# EAGLE design pmodio (EAGLE 7.5.0)
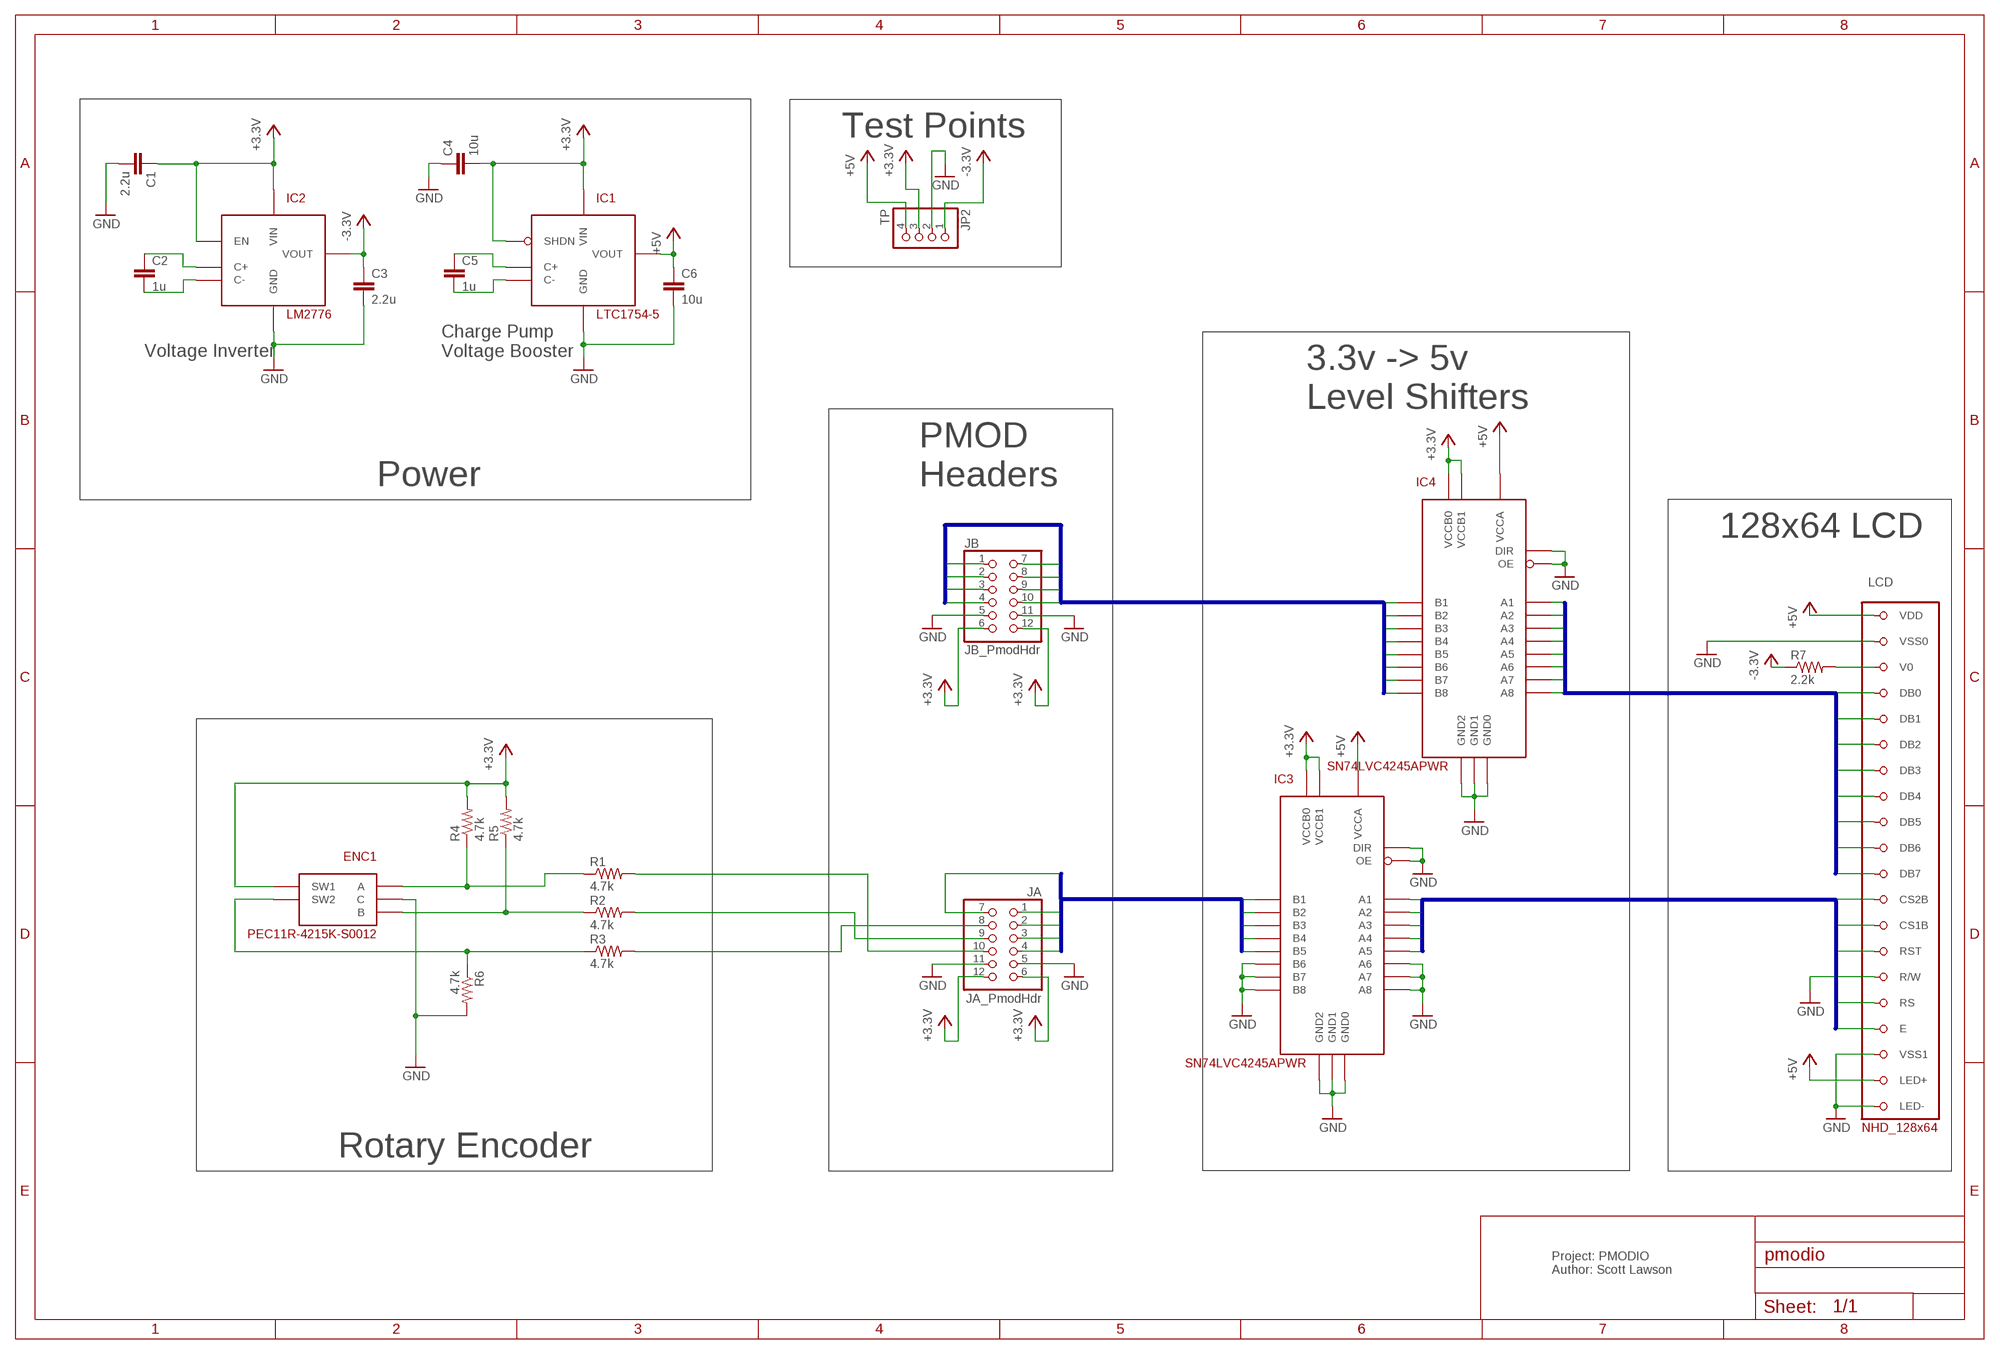
[diagram p0: schematic, sheet 1]

## Parts
C1  2.2u  CAPC0402  [C0402]
C2  1u  CAPC0402  [C0402]
C3  2.2u  CAPC0402  [C0402]
C4  10u  CAPC0802  [C0805]
C5  1u  CAPC0402  [C0402]
C6  10u  CAPC0802  [C0805]
ENC1  PEC11R-4215K-S0012  [PEC11R-4XXXF-SXXXX]
IC1  LTC1754-5  [SOT23-6]
IC2  LM2776  [SOT23-6]
IC3  SN74LVC4245APWR  [TSSOP24]
IC4  SN74LVC4245APWR  [TSSOP24]
JA  JA_PmodHdr  PINHDR-2X6/90  [2X06/90]
JB  JB_PmodHdr  PINHDR-2X6/90  [2X06/90]
JP2  TP  PINHD-1X4  [1X04]
LCD  NHD_128x64  NHD-12864MZ-FSW-GBW-L1X20_2MM  [NHD-12864MZ-FSW-GBW-L]
R1  4.7k  RESR0603  [R0603]
R2  4.7k  RESR0603  [R0603]
R3  4.7k  RESR0603  [R0603]
R4  4.7k  RESR0603  [R0603]
R5  4.7k  RESR0603  [R0603]
R6  4.7k  RESR0603  [R0603]
R7  2.2k  RESR0603  [R0603]

## Nets
+3.3V: C1.1 C4.2 ENC1.SW1 IC1.3(SHDN) IC1.5(VIN) IC2.3(VIN) IC2.4(EN) IC3.23(VCCB0) IC3.24(VCCB1) IC4.23(VCCB0) IC4.24(VCCB1) JA.6 JA.12 JB.6 JB.12 JP2.3 R4.2 R5.2
+5V: C6.1 IC1.1(VOUT) IC3.1(VCCA) IC4.1(VCCA) JP2.4 LCD.LED+ LCD.VDD
-3.3V: C3.1 IC2.1(VOUT) JP2.1 R7.1
CNTLB_3.3V0: IC3.21(B1) JA.4
CNTLB_3.3V1: IC3.20(B2) JA.3
CNTLB_3.3V2: IC3.19(B3) JA.2
CNTLB_3.3V3: IC3.18(B4) JA.7
CNTLB_3.3V4: IC3.17(B5) JA.1
CNTLB_5V0: IC3.3(A1) LCD.CS2B
CNTLB_5V1: IC3.4(A2) LCD.CS1B
CNTLB_5V2: IC3.5(A3) LCD.RST
CNTLB_5V3: IC3.6(A4) LCD.RS
CNTLB_5V4: IC3.7(A5) LCD.E
DB_3.3V0: IC4.21(B1) JB.10
DB_3.3V1: IC4.20(B2) JB.4
DB_3.3V2: IC4.19(B3) JB.9
DB_3.3V3: IC4.18(B4) JB.3
DB_3.3V4: IC4.17(B5) JB.8
DB_3.3V5: IC4.16(B6) JB.2
DB_3.3V6: IC4.15(B7) JB.7
DB_3.3V7: IC4.14(B8) JB.1
DB_5V0: IC4.3(A1) LCD.DB0
DB_5V1: IC4.4(A2) LCD.DB1
DB_5V2: IC4.5(A3) LCD.DB2
DB_5V3: IC4.6(A4) LCD.DB3
DB_5V4: IC4.7(A5) LCD.DB4
DB_5V5: IC4.8(A6) LCD.DB5
DB_5V6: IC4.9(A7) LCD.DB6
DB_5V7: IC4.10(A8) LCD.DB7
GND: C1.2 C3.2 C4.1 C6.2 ENC1.C IC1.2(GND) IC2.2(GND) IC3.2(DIR) IC3.8(A6) IC3.9(A7) IC3.10(A8) IC3.11(GND0) IC3.12(GND1) IC3.13(GND2) IC3.14(B8) IC3.15(B7) IC3.16(B6) IC3.22(OE) IC4.2(DIR) IC4.11(GND0) IC4.12(GND1) IC4.13(GND2) IC4.22(OE) JA.5 JA.11 JB.5 JB.11 JP2.2 LCD.LED- LCD.RW(R/W) LCD.VSS0 LCD.VSS1 R6.2
N$2: LCD.V0 R7.2
N$9: C2.1 IC2.5(C+)
N$10: C2.2 IC2.6(C-)
N$11: C5.1 IC1.6(C+)
N$12: C5.2 IC1.4(C-)
N$15: ENC1.A R1.1 R4.1
N$16: ENC1.B R2.1 R5.1
N$17: ENC1.SW2 R3.1 R6.1
N$18: JA.10 R1.2
N$20: JA.8 R3.2
N$26: JA.9 R2.2

## Buses
DB_5V[0..7]
DB_3.3V[0..7]
CNTLB_5V[0..4]
CNTLB_3.3V[0..4]

## Notes on the sheet
- Test Points
- Voltage Inverter
- Charge Pump 
  Voltage Booster
- 3.3v -> 5v
  Level Shifters
- Power
- PMOD
  Headers
- 128x64 LCD
- Rotary Encoder
- Project: PMODIO
  Author: Scott Lawson

## Library data of the parts
C1-C6 = pmodio:CAP
ENC1 = pmodio:PEC11R-4215K-S0012: Bourns Quadrature Rotary Encoder
IC1 = pmodio:LTC1754-5: Linear Technology 5v Charge Pump
IC2 = pmodio:LM2776
IC3 IC4 = pmodio:SN74LVC4245APWR
JA JB = pmodio:PINHDR-2X6: PIN HEADER
JP2 = pinhead:PINHD-1X4: PIN HEADER
LCD = pmodio:NHD-12864MZ-FSW-GBW-L: Newhaven Display 128x64 Graphical LCD
R1-R7 = pmodio:RES: RESISTOR, American symbol

## Board
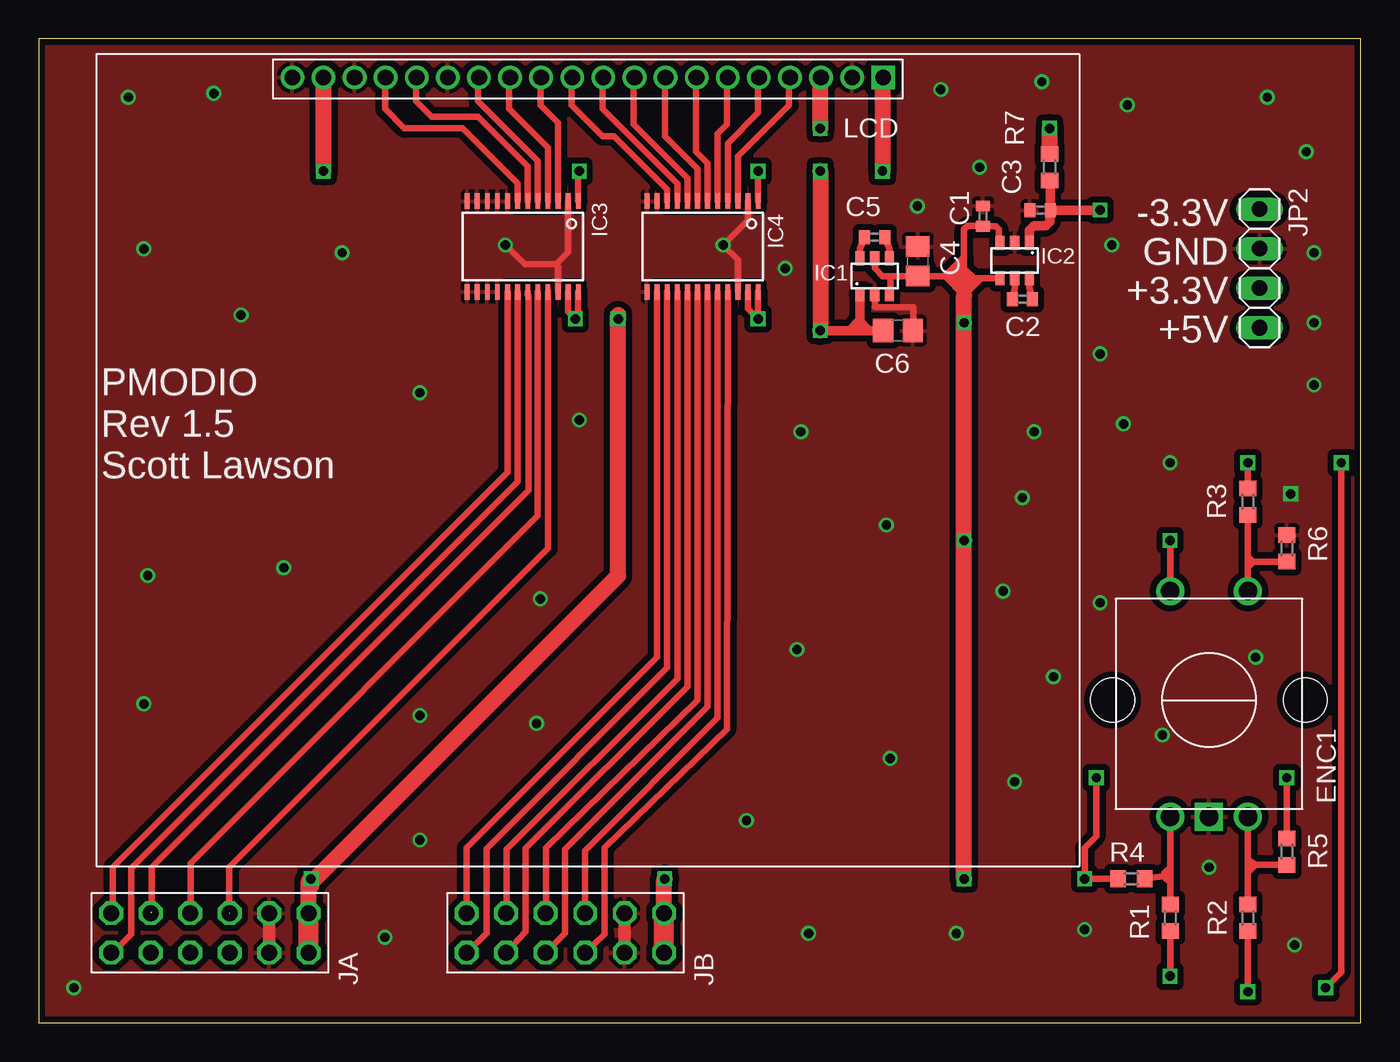
[diagram p1: board, top side]
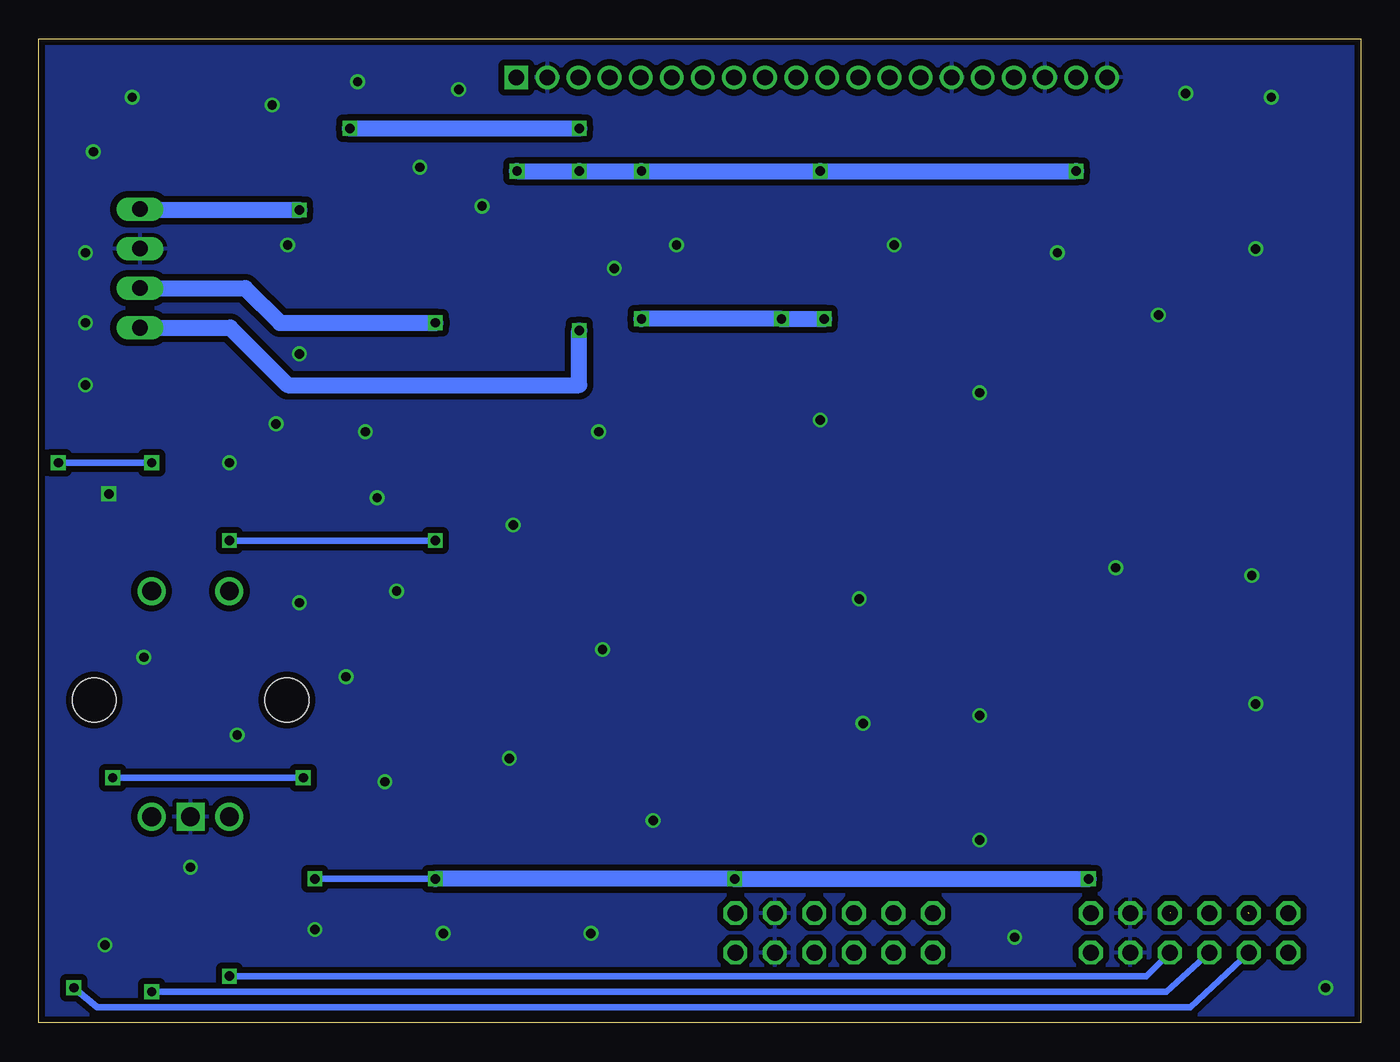
[diagram p2: board, bottom side, seen from below]

Size 85 x 63.25 mm. Coordinates in mm from the lower left corner, seen from the top.
Outline: 0,0 85,0 85,63.25 0,63.25 0,0
Copper layers (1*16): Top 0.0356mm / dielectric 1.5011mm / Bottom 0.0356mm
Design rules "LaenPCBOrder *": minimum track width 6mil, minimum drill 13mil, track to track 6mil, track to pad 6mil, pad to pad 6mil, via to via 6mil, smd to smd 6mil, copper to edge 15mil, drill to drill 6mil, minimum pad ring 7mil, minimum via ring 7mil, stop-mask expansion 3mil, vias tented up to drill 0mil, thermal gap 10mil

### Footprints (pad centres in the part's own frame; a part is rotated, then mirrored left to right if it is on the bottom)
C0402 = smd 0.7 x 0.9: 1 -0.65,0; 2 0.65,0
C0805 = smd 1.3 x 1.5: 1 -0.95,0; 2 0.95,0
PEC11R-4XXXF-SXXXX = drill 1.2: A -2.5,-7.5; B 2.5,-7.5; SW1 -2.5,7; SW2 2.5,7 | drill 1.2 square: C 0,-7.5 | hole 2.8: 6.2,0; -6.2,0
SOT23-6 = smd 0.6 x 0.9: 1 -0.95,-1.15; 2 0,-1.15; 3 0.95,-1.15; 4 0.95,1.15; 5 0,1.15; 6 -0.95,1.15
TSSOP24 = smd 0.305 x 0.991: 1 -3.575,-2.918; 2 -2.925,-2.918; 3 -2.275,-2.918; 4 -1.625,-2.918; 5 -0.975,-2.918; 6 -0.325,-2.918; 7 0.325,-2.918; 8 0.975,-2.918; 9 1.625,-2.918; 10 2.275,-2.918; 11 2.925,-2.918; 12 3.575,-2.918; 13 3.575,2.918; 14 2.925,2.918; 15 2.275,2.918; 16 1.625,2.918; 17 0.975,2.918; 18 0.325,2.918; 19 -0.325,2.918; 20 -0.975,2.918; 21 -1.625,2.918; 22 -2.275,2.918; 23 -2.925,2.918; 24 -3.575,2.918
2X06/90 = drill 1.016 octagon: 1 6.35,-6.35; 2 3.81,-6.35; 3 1.27,-6.35; 4 -1.27,-6.35; 5 -3.81,-6.35; 6 -6.35,-6.35; 7 6.35,-3.81; 8 3.81,-3.81; 9 1.27,-3.81; 10 -1.27,-3.81; 11 -3.81,-3.81; 12 -6.35,-3.81
1X04 = drill 1.016 long: 1 -3.81,0; 2 -1.27,0; 3 1.27,0; 4 3.81,0
NHD-12864MZ-FSW-GBW-L = drill 1.016: CS1B 5,-24.6; CS2B 3,-24.6; DB0 -13,-24.6; DB1 -11,-24.6; DB2 -9,-24.6; DB3 -7,-24.6; DB4 -5,-24.6; DB5 -3,-24.6; DB6 -1,-24.6; DB7 1,-24.6; E 13,-24.6; LED+ 17,-24.6; LED- 19,-24.6; RS 11,-24.6; RST 7,-24.6; RW 9,-24.6; V0 -15,-24.6; VSS0 -17,-24.6; VSS1 15,-24.6 | drill 1.016 square: VDD -19,-24.6
R0603 = smd 1 x 1.1: 1 -0.85,0; 2 0.85,0

### Placement (x,y rotation side)
C1  60.71,51.86 90 top
C2  63.25,46.5 0 top
C3  64.39,52.23 180 top
C4  56.52,48.95 270 top
C5  53.75,50.5 0 top
C6  55.25,44.5 0 top
ENC1  75.25,20.75 0 top
IC1  53.75,48 0 top
IC2  62.75,49 180 top
IC3  31.11,49.9 180 top
IC4  42.68,49.9 180 top
JA  11,0.7 180 top
JB  33.86,0.7 180 top
JP2  78.5,48.5 270 top
LCD  35.3,36.17 180 top
R1  72.75,6.75 270 top
R2  77.75,6.75 270 top
R3  77.75,33.5 90 top
R4  70.25,9.25 180 top
R5  80.25,11 90 top
R6  80.25,30.5 90 top
R7  65,55 90 top

### Tracks (layer width: path | path; a pad name or v marks a point on that pad's centre or on a via)
+3.3V  (via drill 0.6)
  Top 0.406: 54.75,48 C4.2 58.25,48 | 54.75,48 54.25,48 53.75,48.5 IC1.5 | R4.2 v67.25,9.25 67.25,11.25 68,12 v68,15.75 | R5.2 v80.25,15.75 | ENC1.SW1 v72.75,31 | IC1.3 54.75,46.85 54.75,48 | IC3.24 34.69,45.44 v34.5,45.25 34.03,45.72 IC3.23 | IC4.24 v46.26,45.26 v46.25,45.25 45.6,45.9 IC4.23 | 60.6,47.85 59.5,46.75 58.25,48 | IC2.4 60.6,47.85 | 60.6,47.85 60.15,47.85 59.5,48.5 | 59.5,48.5 59.5,49 | 59.5,49.25 59.5,51 59.75,51.25 60.67,51.25 C1.1 61.54,51.21 61.75,51 61.75,50.2 IC2.3 | 59.5,48.5 59.25,48.5 | 59.25,48.5 58.75,48.5 | 58.75,48.5 58.5,48.25 | 58.5,48.25 58.25,48 | 58.5,48.25 59.5,47.25 59.75,47.5 | 59.75,47.5 60,47.75 59.25,48.5 | 59.25,48.5 59,48.25 | 59.75,47.5 59,48.25 | 59,48.25 58.75,48.5 | 58.75,48.5 59.5,49.25 | 59.5,49.25 59.5,49 | 59.5,49 59.25,48.75
  Top 1.016: JA.6 17.35,9.1 v17.5,9.25 | v17.5,9.25 17.75,9.25 37.25,28.75 v37.25,45.25 37.25,45.5 | JB.6 40.21,9.21 v40.25,9.25 | v59.5,9.25 v59.5,31 v59.5,45 59.5,46.75 | v17.5,9.25 17.5,8.75
  Top 1.27: JA.12 JA.6 | JB.12 JB.6
  Bottom 0.406: v80.25,15.75 v68,15.75 | v72.75,31 v59.5,31 | v67.25,9.25 v59.5,9.25
  Bottom 1.016: v59.5,9.25 v40.25,9.25 v17.5,9.25 | v46.25,45.25 v37.25,45.25 v34.5,45.25 | JP2.3 71.73,47.23 69.5,45 v59.5,45
+5V  (via drill 0.6)
  Top 0.406: IC3.1 34.69,54.69 v34.75,54.75 | IC4.1 v46.26,54.74 v46.25,54.75 | 52.75,45.5 52.75,45.25 | 52.75,45.25 52,44.5 | 52.75,45.25 53.5,44.5
  Top 0.61: 52.79,44.5 52,44.5 v50.25,44.5 | IC1.1 52.79,44.5 | C6.1 53.5,44.5 52.79,44.5
  Top 0.813: LCD.VDD 54.25,60.77
  Top 1.016: 54.25,60.77 v54.25,54.75 | v50.25,54.75 v50.25,44.5 | v18.3,54.75 LCD.LED+
  Bottom 1.016: v54.25,54.75 v50.25,54.75 v46.25,54.75 v34.75,54.75 v18.3,54.75 | v50.25,44.5 50.25,41 69,41 72.69,44.69 JP2.4
-3.3V  (via drill 0.6)
  Top 0.61: IC2.1 63.7,50.95 64,51.25 64.75,51.25 65,51.5 65,52.44 C3.1 | C3.1 65.04,54.36 R7.1 | C3.1 67.23,52.23 v68.25,52.25
  Bottom 1.016: v68.25,52.25 78.44,52.25 JP2.1
CNTLB_3.3V0  (1 unrouted)
  Top 0.406: IC3.21 32.73,46.77 32.75,46.75 32.75,30.5 12.25,10 12.25,7.07
CNTLB_3.3V1
  Top 0.406: IC3.20 32.09,32.59 9.75,10.25 9.75,7.05 JA.3
CNTLB_3.3V2  (1 unrouted)
  Top 0.406: IC3.19 31.43,46.81 31.5,46.75 31.5,34.25 7.25,10 7.25,7.11
CNTLB_3.3V3
  Top 0.406: JA.7 4.76,4.51 5.93,5.68 5.93,9.93 30.79,34.78 IC3.18
CNTLB_3.3V4
  Top 0.406: IC3.17 30.14,35.38 4.75,10 4.75,7.15 JA.1
CNTLB_5V0
  Top 0.406: IC3.3 33.38,57.87 32.25,59 32.25,60.72 LCD.CS2B
CNTLB_5V1
  Top 0.406: IC3.4 32.73,56.27 30.25,58.75 30.25,60.72 LCD.CS1B
CNTLB_5V2
  Top 0.406: IC3.5 32.09,55.41 28.25,59.25 28.25,60.72 LCD.RST
CNTLB_5V3
  Top 0.406: IC3.6 31.43,55.06 28.25,58.25 25.25,58.25 24.25,59.25 24.25,60.72 LCD.RS
CNTLB_5V4
  Top 0.406: IC3.7 30.79,53.97 27.25,57.5 23.5,57.5 22.25,58.75 22.25,60.72 LCD.E
DB_3.3V0
  Top 0.406: JB.10 36.39,5.68 36.39,11.25 44.25,18.86 44.31,46.69 44.3,46.8 IC4.21
DB_3.3V1
  Top 0.406: JB.4 35.12,11.07 43.66,19.61 IC4.20
DB_3.3V2
  Top 0.406: JB.9 33.84,5.75 33.84,11.16 43.01,20.32 IC4.19
DB_3.3V3
  Top 0.406: JB.3 32.61,7.05 32.61,11.16 32.61,11.25 42.35,20.75 IC4.18
DB_3.3V4
  Top 0.406: JB.8 31.31,5.84 31.31,11.21 41.7,21.61 IC4.17
DB_3.3V5
  Top 0.406: JB.2 30.09,7.05 30.09,11.14 41.05,22.11 IC4.16
DB_3.3V6
  Top 0.406: JB.7 28.78,5.76 28.78,11.2 40.41,22.82 IC4.15
DB_3.3V7
  Top 0.406: JB.1 27.5,11.25 39.76,23.5 IC4.14
DB_5V0
  Top 0.406: IC4.3 44.95,55.7 48.25,59 48.25,60.72 LCD.DB0
DB_5V1
  Top 0.406: LCD.DB1 46.25,60.72 46.25,58.5 44.3,56.55 IC4.4
DB_5V2
  Top 0.406: LCD.DB2 44.25,60.72 44.25,57.75 43.66,57.16 IC4.5
DB_5V3
  Top 0.406: IC4.6 43.01,55.24 42.25,56 42.25,60.72 LCD.DB3
DB_5V4
  Top 0.406: LCD.DB4 40.25,60.72 40.25,57 42.35,54.9 IC4.7
DB_5V5
  Top 0.406: LCD.DB5 38.25,60.72 38.25,57.75 41.7,54.3 IC4.8
DB_5V6
  Top 0.406: LCD.DB6 36.25,60.72 36.25,58.75 41.05,53.95 IC4.9
DB_5V7
  Top 0.406: IC4.10 40.41,53.59 37,57 36.25,57 34.25,59 34.25,60.72 LCD.DB7
GND  (via drill 0.6)
  Top 0.406: IC1.2 53.75,46 56.25,46 56.25,44.55 C6.2 | IC4.2 45.6,51.6 v44,50 44.95,49.05 IC4.22 | IC3.22 33.38,48.62 33.25,48.75 | 33.25,48.75 31.25,48.75 v30,50 | IC3.2 34.03,49.53 33.25,48.75
  Top 0.813: JB.5 JB.11 | JA.5 JA.11
  other vias: 19.5,49.5 48,48.5 56.5,52.5 60.5,55 68.25,43 82,45 82,49.5 81.5,56 70,59 69,50 80.5,34 2.25,2.25 58,60 64.5,60.5 82,41 22.25,5.5 24.5,11.75 69.75,38.5 72.75,36 64,38 63.25,33.75 62,27.75 65.25,22.25 62.75,15.5 72.25,18.5 78.25,23.5 68.25,27 67.25,6 59,5.75 49.5,5.75 32,19.25 45.5,13 54.75,17 48.75,24 54.5,32 49,38 24.5,40.5 15.75,29.25 6.75,20.5 7,28.75 13,45.5 11.25,59.75 5.75,59.5 6.75,49.75 75.25,10 80.75,5 32.25,27.25 24.5,19.75 79,59.5 34.75,38.75
  pour Bottom (isolate 0.406): 0.25,63.25 85,63.25 85,0 0,0 0,63.25
  pour Top (isolate 0.406): 0,63.25 85,63.25 85,0 0,0
N$2  (via drill 0.6)
  Top 1.016: R7.2 v65,57.5 | v50.25,57.5 50.25,60.72 LCD.V0
  Bottom 1.016: v65,57.5 v50.25,57.5
N$9
  Top 0.406: C2.1 62.75,47.25 IC2.5
N$10
  Top 0.406: C2.2 63.7,47.25 IC2.6
N$11
  Top 0.406: C5.1 52.8,49.75 IC1.6
N$12
  Top 0.406: C5.2 54.7,49.75 IC1.4
N$15
  Top 0.406: ENC1.A 72.75,10 | 72.75,10 72.75,9.5 | 72.75,9.5 72.75,9 | 72.75,9 R1.1 | R4.1 72.75,9.5 | 72.75,10 72.38,9.63 72.38,9.37 72.75,9
N$16
  Top 0.406: ENC1.B 77.75,10.5 | 77.75,10.5 77.75,10.15 | 77.75,10.15 77.75,9.65 | 77.75,9.65 R2.1 | R5.1 78.25,10.15 | 78.25,10.15 77.75,10.15 | 77.75,9.65 78.25,10.15 | 78.25,10.15 77.75,10.5
N$17
  Top 0.406: R3.1 77.75,30 | 77.75,30 77.75,29.65 | 77.75,29.65 77.75,29.25 | 77.75,29.25 ENC1.SW2 | R6.1 77.75,29.65 | 77.75,29.25 78,29.5 78,29.75 77.75,30
N$18  (via drill 0.6)
  Top 0.406: R1.2 v72.75,3
  Bottom 0.406: v72.75,3 13.78,3 JA.10
N$20  (via drill 0.6)
  Top 0.406: R3.2 v77.75,36 | v83.75,36 83.75,3.25 v82.75,2.25
  Bottom 0.406: v77.75,36 v83.75,36 | JA.8 10.95,1 81.25,1 v82.75,2.25
N$26  (via drill 0.6)
  Top 0.406: R2.2 v77.75,2
  Bottom 0.406: v77.75,2 12.49,2 JA.9

### Text on the board
tNames: -3.3V | GND | +3.3V | +5V | PMODIO / Rev 1.5 / Scott Lawson